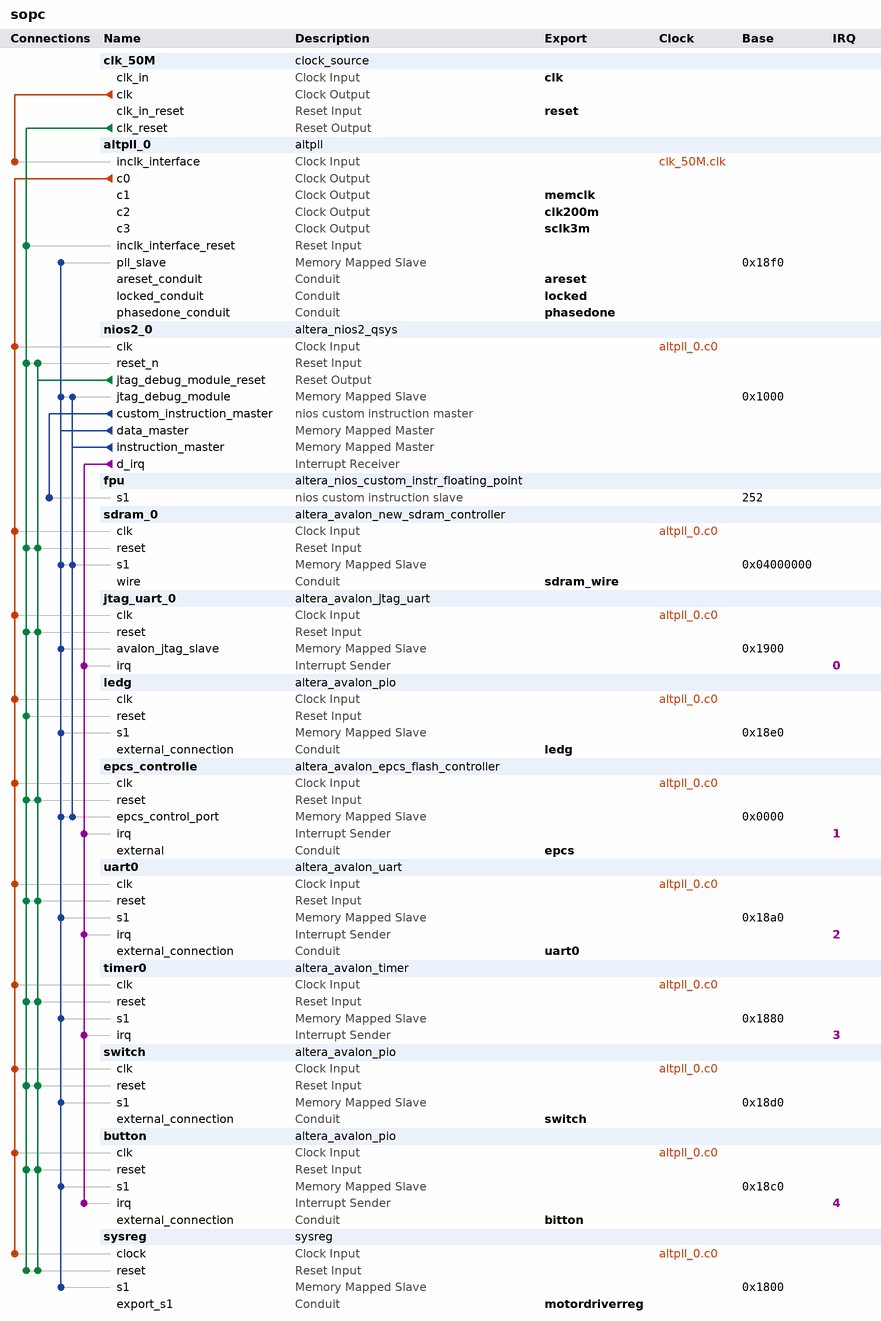
[diagram p0: system contents]
# Platform Designer (Qsys) system sopc, Cyclone IV E EP4CE22F17C6
# Parameters at their usual value, and those the tool derives, are not listed.
package require -exact qsys 13.0.1.99.2
create_system sopc
set_project_property DEVICE_FAMILY {Cyclone IV E}
set_project_property DEVICE EP4CE22F17C6

add_instance clk_50M clock_source 13.0
set_instance_parameter_value clk_50M clockFrequency 50000000

add_instance altpll_0 altpll 13.0
set_instance_parameter_value altpll_0 INCLK0_INPUT_FREQUENCY 20000
set_instance_parameter_value altpll_0 CLK0_MULTIPLY_BY 2
set_instance_parameter_value altpll_0 CLK1_MULTIPLY_BY 2
set_instance_parameter_value altpll_0 CLK2_MULTIPLY_BY 4
set_instance_parameter_value altpll_0 CLK3_MULTIPLY_BY 3
set_instance_parameter_value altpll_0 CLK0_DIVIDE_BY 1
set_instance_parameter_value altpll_0 CLK1_DIVIDE_BY 1
set_instance_parameter_value altpll_0 CLK2_DIVIDE_BY 1
set_instance_parameter_value altpll_0 CLK3_DIVIDE_BY 50
set_instance_parameter_value altpll_0 CLK1_PHASE_SHIFT -2500
set_instance_parameter_value altpll_0 CLK2_PHASE_SHIFT 0
set_instance_parameter_value altpll_0 CLK3_PHASE_SHIFT 0
set_instance_parameter_value altpll_0 CLK1_DUTY_CYCLE 50
set_instance_parameter_value altpll_0 CLK2_DUTY_CYCLE 50
set_instance_parameter_value altpll_0 CLK3_DUTY_CYCLE 50
set_instance_parameter_value altpll_0 PORT_clk1 PORT_USED
set_instance_parameter_value altpll_0 PORT_clk2 PORT_USED
set_instance_parameter_value altpll_0 PORT_clk3 PORT_USED
set_instance_parameter_value altpll_0 PORT_ARESET PORT_UNUSED
set_instance_parameter_value altpll_0 PORT_LOCKED PORT_UNUSED

add_instance nios2_0 altera_nios2_qsys 13.0
set_instance_parameter_value nios2_0 exceptionOffset 0
set_instance_parameter_value nios2_0 resetSlave epcs_controlle.epcs_control_port
set_instance_parameter_value nios2_0 mmu_TLBMissExcSlave None
set_instance_parameter_value nios2_0 exceptionSlave sdram_0.s1
set_instance_parameter_value nios2_0 breakSlave nios2_0.jtag_debug_module
set_instance_parameter_value nios2_0 impl Fast
set_instance_parameter_value nios2_0 icache_size 4096
set_instance_parameter_value nios2_0 debug_level Level2

add_instance fpu altera_nios_custom_instr_floating_point 13.0

add_instance sdram_0 altera_avalon_new_sdram_controller 13.0.1.99.2
set_instance_parameter_value sdram_0 TAC 5.5
set_instance_parameter_value sdram_0 TRCD 20.0
set_instance_parameter_value sdram_0 TRP 20.0
set_instance_parameter_value sdram_0 casLatency 3
set_instance_parameter_value sdram_0 columnWidth 9
set_instance_parameter_value sdram_0 dataWidth 16
set_instance_parameter_value sdram_0 generateSimulationModel false
set_instance_parameter_value sdram_0 model single_Micron_MT48LC4M32B2_7_chip
set_instance_parameter_value sdram_0 numberOfBanks 4
set_instance_parameter_value sdram_0 numberOfChipSelects 1
set_instance_parameter_value sdram_0 powerUpDelay 200.0
set_instance_parameter_value sdram_0 refreshPeriod 7.8125
set_instance_parameter_value sdram_0 rowWidth 13

add_instance jtag_uart_0 altera_avalon_jtag_uart 13.0.1.99.2
set_instance_parameter_value jtag_uart_0 simInteractiveOptions NO_INTERACTIVE_WINDOWS
set_instance_parameter_value jtag_uart_0 useRegistersForReadBuffer true
set_instance_parameter_value jtag_uart_0 useRegistersForWriteBuffer true

add_instance ledg altera_avalon_pio 13.0.1.99.2
set_instance_parameter_value ledg direction Output
set_instance_parameter_value ledg width 4

add_instance epcs_controlle altera_avalon_epcs_flash_controller 13.0.1.99.2

add_instance uart0 altera_avalon_uart 13.0.1.99.2
set_instance_parameter_value uart0 baud 115200
set_instance_parameter_value uart0 dataBits 8
set_instance_parameter_value uart0 fixedBaud true
set_instance_parameter_value uart0 parity NONE
set_instance_parameter_value uart0 stopBits 1

add_instance timer0 altera_avalon_timer 13.0.1.99.2
set_instance_parameter_value timer0 period 1
set_instance_parameter_value timer0 periodUnits USEC

add_instance switch altera_avalon_pio 13.0.1.99.2
set_instance_parameter_value switch direction Input
set_instance_parameter_value switch simDoTestBenchWiring true
set_instance_parameter_value switch width 4

add_instance button altera_avalon_pio 13.0.1.99.2
set_instance_parameter_value button captureEdge true
set_instance_parameter_value button direction Input
set_instance_parameter_value button edgeType FALLING
set_instance_parameter_value button generateIRQ true
set_instance_parameter_value button irqType EDGE
set_instance_parameter_value button simDoTestBenchWiring true
set_instance_parameter_value button width 2

add_instance sysreg sysreg 2.1

# connections
add_connection altpll_0.c0 button.clk clock
add_connection altpll_0.c0 epcs_controlle.clk clock
add_connection altpll_0.c0 jtag_uart_0.clk clock
add_connection altpll_0.c0 ledg.clk clock
add_connection altpll_0.c0 nios2_0.clk clock
add_connection altpll_0.c0 sdram_0.clk clock
add_connection altpll_0.c0 switch.clk clock
add_connection altpll_0.c0 sysreg.clock clock
add_connection altpll_0.c0 timer0.clk clock
add_connection altpll_0.c0 uart0.clk clock
add_connection clk_50M.clk altpll_0.inclk_interface clock
add_connection clk_50M.clk_reset altpll_0.inclk_interface_reset reset
add_connection clk_50M.clk_reset button.reset reset
add_connection clk_50M.clk_reset epcs_controlle.reset reset
add_connection clk_50M.clk_reset jtag_uart_0.reset reset
add_connection clk_50M.clk_reset ledg.reset reset
add_connection clk_50M.clk_reset nios2_0.reset_n reset
add_connection clk_50M.clk_reset sdram_0.reset reset
add_connection clk_50M.clk_reset switch.reset reset
add_connection clk_50M.clk_reset sysreg.reset reset
add_connection clk_50M.clk_reset timer0.reset reset
add_connection clk_50M.clk_reset uart0.reset reset
add_connection nios2_0.jtag_debug_module_reset button.reset reset
add_connection nios2_0.jtag_debug_module_reset epcs_controlle.reset reset
add_connection nios2_0.jtag_debug_module_reset jtag_uart_0.reset reset
add_connection nios2_0.jtag_debug_module_reset nios2_0.reset_n reset
add_connection nios2_0.jtag_debug_module_reset sdram_0.reset reset
add_connection nios2_0.jtag_debug_module_reset switch.reset reset
add_connection nios2_0.jtag_debug_module_reset sysreg.reset reset
add_connection nios2_0.jtag_debug_module_reset timer0.reset reset
add_connection nios2_0.jtag_debug_module_reset uart0.reset reset
add_connection nios2_0.data_master altpll_0.pll_slave avalon
set_connection_parameter_value nios2_0.data_master/altpll_0.pll_slave baseAddress 0x18f0
add_connection nios2_0.data_master button.s1 avalon
set_connection_parameter_value nios2_0.data_master/button.s1 baseAddress 0x18c0
add_connection nios2_0.data_master epcs_controlle.epcs_control_port avalon
set_connection_parameter_value nios2_0.data_master/epcs_controlle.epcs_control_port baseAddress 0x0000
add_connection nios2_0.data_master jtag_uart_0.avalon_jtag_slave avalon
set_connection_parameter_value nios2_0.data_master/jtag_uart_0.avalon_jtag_slave baseAddress 0x1900
add_connection nios2_0.data_master ledg.s1 avalon
set_connection_parameter_value nios2_0.data_master/ledg.s1 baseAddress 0x18e0
add_connection nios2_0.data_master nios2_0.jtag_debug_module avalon
set_connection_parameter_value nios2_0.data_master/nios2_0.jtag_debug_module baseAddress 0x1000
add_connection nios2_0.data_master sdram_0.s1 avalon
set_connection_parameter_value nios2_0.data_master/sdram_0.s1 baseAddress 0x04000000
add_connection nios2_0.data_master switch.s1 avalon
set_connection_parameter_value nios2_0.data_master/switch.s1 baseAddress 0x18d0
add_connection nios2_0.data_master sysreg.s1 avalon
set_connection_parameter_value nios2_0.data_master/sysreg.s1 baseAddress 0x1800
add_connection nios2_0.data_master timer0.s1 avalon
set_connection_parameter_value nios2_0.data_master/timer0.s1 baseAddress 0x1880
add_connection nios2_0.data_master uart0.s1 avalon
set_connection_parameter_value nios2_0.data_master/uart0.s1 baseAddress 0x18a0
add_connection nios2_0.instruction_master epcs_controlle.epcs_control_port avalon
set_connection_parameter_value nios2_0.instruction_master/epcs_controlle.epcs_control_port baseAddress 0x0000
add_connection nios2_0.instruction_master nios2_0.jtag_debug_module avalon
set_connection_parameter_value nios2_0.instruction_master/nios2_0.jtag_debug_module baseAddress 0x1000
add_connection nios2_0.instruction_master sdram_0.s1 avalon
set_connection_parameter_value nios2_0.instruction_master/sdram_0.s1 baseAddress 0x04000000
add_connection nios2_0.d_irq button.irq interrupt
set_connection_parameter_value nios2_0.d_irq/button.irq irqNumber 4
add_connection nios2_0.d_irq epcs_controlle.irq interrupt
set_connection_parameter_value nios2_0.d_irq/epcs_controlle.irq irqNumber 1
add_connection nios2_0.d_irq jtag_uart_0.irq interrupt
set_connection_parameter_value nios2_0.d_irq/jtag_uart_0.irq irqNumber 0
add_connection nios2_0.d_irq timer0.irq interrupt
set_connection_parameter_value nios2_0.d_irq/timer0.irq irqNumber 3
add_connection nios2_0.d_irq uart0.irq interrupt
set_connection_parameter_value nios2_0.d_irq/uart0.irq irqNumber 2
add_connection nios2_0.custom_instruction_master fpu.s1 nios_custom_instruction
set_connection_parameter_value nios2_0.custom_instruction_master/fpu.s1 CIName fpu
set_connection_parameter_value nios2_0.custom_instruction_master/fpu.s1 baseAddress 252

# exported interfaces
add_interface clk clock sink
set_interface_property clk EXPORT_OF clk_50M.clk_in
add_interface reset reset sink
set_interface_property reset EXPORT_OF clk_50M.clk_in_reset
add_interface memclk clock source
set_interface_property memclk EXPORT_OF altpll_0.c1
add_interface areset conduit end
set_interface_property areset EXPORT_OF altpll_0.areset_conduit
add_interface locked conduit end
set_interface_property locked EXPORT_OF altpll_0.locked_conduit
add_interface phasedone conduit end
set_interface_property phasedone EXPORT_OF altpll_0.phasedone_conduit
add_interface sdram_wire conduit end
set_interface_property sdram_wire EXPORT_OF sdram_0.wire
add_interface ledg conduit end
set_interface_property ledg EXPORT_OF ledg.external_connection
add_interface epcs conduit end
set_interface_property epcs EXPORT_OF epcs_controlle.external
add_interface uart0 conduit end
set_interface_property uart0 EXPORT_OF uart0.external_connection
add_interface switch conduit end
set_interface_property switch EXPORT_OF switch.external_connection
add_interface bitton conduit end
set_interface_property bitton EXPORT_OF button.external_connection
add_interface clk200m clock source
set_interface_property clk200m EXPORT_OF altpll_0.c2
add_interface sclk3m clock source
set_interface_property sclk3m EXPORT_OF altpll_0.c3
add_interface motordriverreg conduit end
set_interface_property motordriverreg EXPORT_OF sysreg.export_s1

set_interconnect_requirement {$system} qsys_mm.clockCrossingAdapter HANDSHAKE
set_interconnect_requirement {$system} qsys_mm.maxAdditionalLatency 1

save_system sopc.qsys
